# EAGLE schematic untitled (EAGLE 6.2)
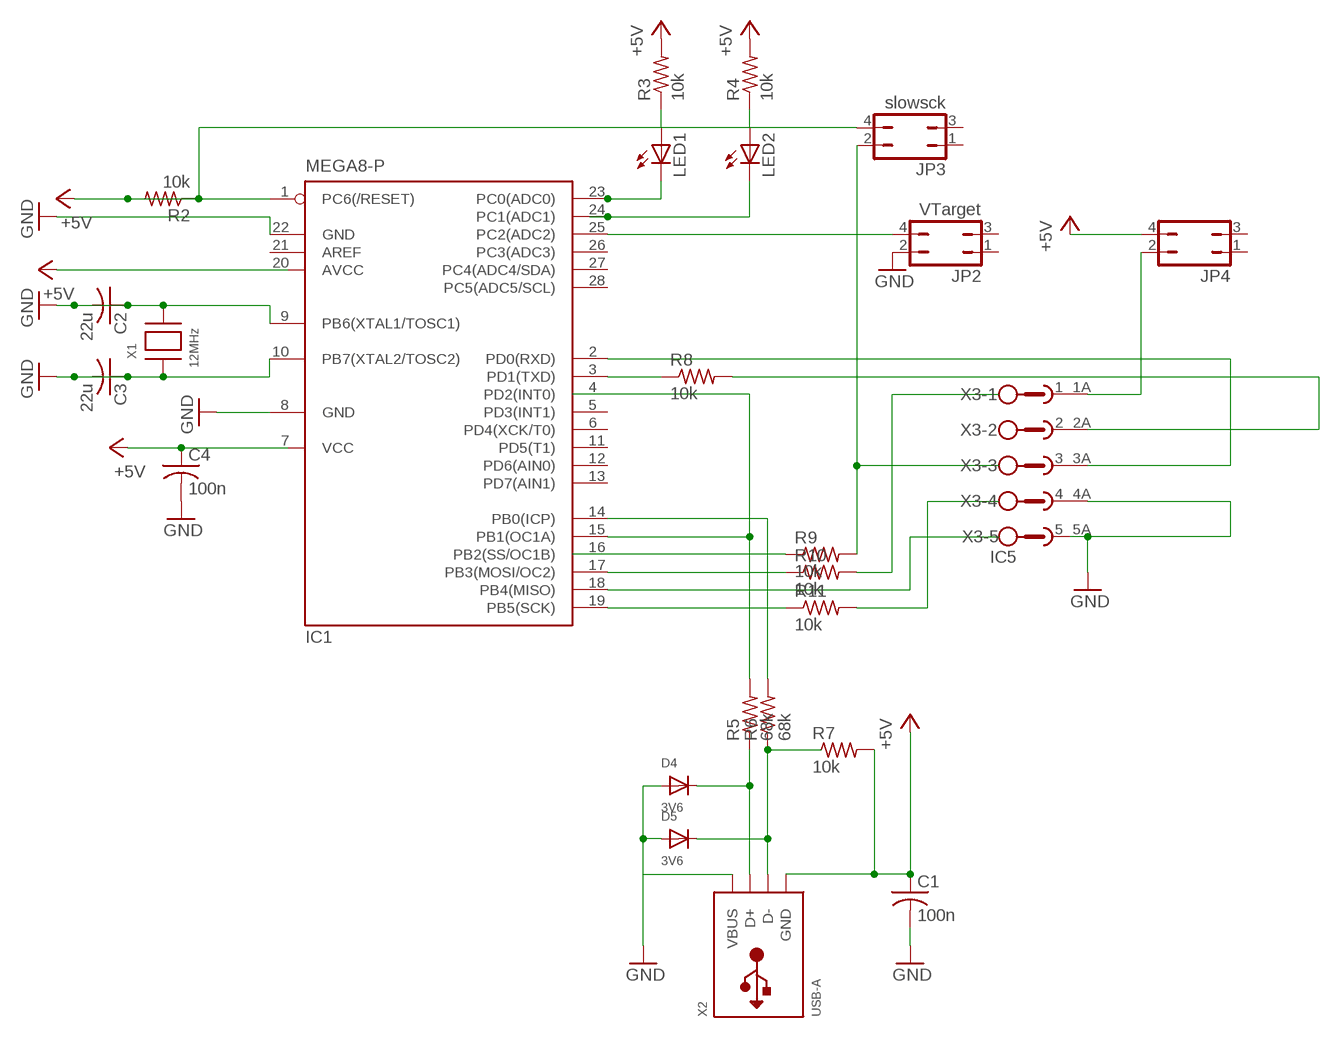
[diagram p0: schematic, sheet 1]

## Parts
C1  100n  C-US025-024X044  [C025-024X044]
C2  22u  C-US025-024X044  [C025-024X044]
C3  22u  C-US025-024X044  [C025-024X044]
C4  100n  C-US025-024X044  [C025-024X044]
D4  3V6  DIODEDO-1N4148  [DO-1N4148]
D5  3V6  DIODEDO-1N4148  [DO-1N4148]
IC1  MEGA8-P  [DIL28-3]
JP2  VTarget  JP2Q  [JP2Q]
JP3  slowsck  JP2Q  [JP2Q]
JP4  JP2Q  [JP2Q]
LED1  LED5MM  [LED5MM]
LED2  LED5MM  [LED5MM]
R2  10k  R-US_0204/2V  [0204V]
R3  10k  R-US_0204/2V  [0204V]
R4  10k  R-US_0204/2V  [0204V]
R5  68k  R-US_0204/2V  [0204V]
R6  68k  R-US_0204/2V  [0204V]
R7  10k  R-US_0204/2V  [0204V]
R8  10k  R-US_0204/2V  [0204V]
R9  10k  R-US_0204/2V  [0204V]
R10  10k  R-US_0204/2V  [0204V]
R11  10k  R-US_0204/2V  [0204V]
X1  12MHz  XTAL-3.2X1.5  [XTAL3215]
X2  USB-A  [MOLEX_480371000]
X3  IC5  [IC5]

## Nets
+5V: C1.1 C4.1 IC1.1(PC6(/RESET)) JP3.4 JP4.4 R2.1 R2.2 R3.2 R4.2 R7.2 X2.4(GND)
GND: C1.2 C2.1 C2.2 C3.1 C3.2 C4.2 D4.A D5.A IC1.8(GND) IC1.9(PB6(XTAL1/TOSC1)) IC1.10(PB7(XTAL2/TOSC2)) IC1.22(GND) JP2.2 X1.P$1 X1.P$2 X2.1(VBUS)
N$1: LED1.A R3.1
N$2: IC1.23(PC0(ADC0)) LED1.K(C)
N$3: IC1.24(PC1(ADC1)) LED2.K(C)
N$4: LED2.A R4.1
N$5: IC1.25(PC2(ADC2)) JP2.4
N$6: D4.C R5.1 X2.3(D+)
N$7: D5.C R6.1 X2.2(D-)
N$8: IC1.15(PB1(OC1A)) R5.2
N$9: IC1.14(PB0(ICP)) R6.2
N$10: JP3.2 R9.2
N$11: IC1.17(PB3(MOSI/OC2)) R10.1
N$12: IC1.19(PB5(SCK)) R11.1
N$13: IC1.18(PB4(MISO))
N$14: R10.2
N$15: R11.2
N$16: JP4.2 X3.1A
N$17: IC1.2(PD0(RXD)) X3.3A
N$19: R8.2 X3.2A
N$20: IC1.3(PD1(TXD)) R8.1
N$21: R9.1
N$22: X3.4A X3.5 X3.5A ; supply symbol labelled GND
Unconnected: IC1.4(PD2(INT0)) IC1.5(PD3(INT1)) IC1.6(PD4(XCK/T0)) IC1.11(PD5(T1)) IC1.12(PD6(AIN0)) IC1.13(PD7(AIN1)) IC1.16(PB2(SS/OC1B)) IC1.21(AREF) IC1.26(PC3(ADC3)) IC1.27(PC4(ADC4/SDA)) IC1.28(PC5(ADC5/SCL)) JP2.1 JP2.3 JP3.1 JP3.3 JP4.1 JP4.3 R7.1 X3.1 X3.2 X3.3 X3.4

## Power pins joined to a net without a drawn wire
AVCC: IC1.20(AVCC)
VCC: IC1.7(VCC)

## Library data of the parts
C1-C4 = adafruit:C-US: CAPACITOR, American symbol
D4 D5 = adafruit:DIODE: Diode SMADIODE - SMA Surface Mount Package 20V 1A Schottky Diode Digikey: 641-1014-6-ND DO-1N4148 - Through Hole Small Current Diode SOD-123 20V 1 A (.5mV Vf) Schottky Diode - Digikey: MBRX120TPMSCT-ND SOD-323 10V 570mA (.38mV Vf, 3ns) Schottky Diode - Digikey: ZLLS410CT-ND SOD-523 30V 30mA Schottky Diode (RB751S-40TE61) - Digikey: RB751S-40TE61CT-ND SOT23-R/W - SOT23 Package (R = Solder Paste/Reflow Ovens, W = Hand-Soldering) BAT54Film 40V 300mA - Digikey: 497-7162-1-ND
IC1 = atmel:MEGA8-P: MICROCONTROLLER 8 Kbytes FLASH, 1 kbytes SRAM, 512 bytes EEPROM, USART, 4-channel 10 bit ADC, 2-channel 8 bit ADC Pin compatible with Atmega48, ATMega88, ATMega168 Source: avr.lbr; OC_FARNELL: unknown; OC_NEWARK: unknown
JP2-JP4 = jumper:JP2Q: JUMPER
LED1 LED2 = led:LED: LED OSRAM: - CHIPLED LG R971, LG N971, LY N971, LG Q971, LY Q971, LO R971, LY R971 LH N974, LH R974 LS Q976, LO Q976, LY Q976 LO Q996 - Hyper CHIPLED LW Q18S LB Q993, LB Q99A, LB R99A - SideLED LS A670, LO A670, LY A670, LG A670, LP A670 LB A673, LV A673, LT A673, LW A673 LH A674 LY A675 LS A676, LA A676, LO A676, LY A676, LW A676 LS A679, LY A679, LG A679 - Hyper Micro SIDELED® LS Y876, LA Y876, LO Y876, LY Y876 LT Y87S - SmartLED LW L88C, LW L88S LB L89C, LB L89S, LG L890 LS L89K, LO L89K, LY L89K LS L896, LA L896, LO L896, LY L896 - TOPLED LS T670, LO T670, LY T670, LG T670, LP T670 LSG T670, LSP T670, LSY T670, LOP T670, LYG T670 LG T671, LOG T671, LSG T671 LB T673, LV T673, LT T673, LW T673 LH T674 LS T676, LA T676, LO T676, LY T676, LB T676, LH T676, LSB T676, LW T676 LB T67C, LV T67C, LT T67C, LS T67K, LO T67K, LY T67K, LW E67C LS E67B, LA E67B, LO E67B, LY E67B, LB E67C, LV E67C, LT E67C LW T67C LS T679, LY T679, LG T679 LS T770, LO T770, LY T770, LG T770, LP T770 LB T773, LV T773, LT T773, LW T773 LH T774 LS E675, LA E675, LY E675, LS T675 LS T776, LA T776, LO T776, LY T776, LB T776 LHGB T686 LT T68C, LB T68C - Hyper Mini TOPLED® LB M676 - Mini TOPLED Santana® LG M470 LS M47K, LO M47K, LY M47K Source: http://www.osram.convergy.de LUXEON: - LUMILED® LXK2-PW12-R00, LXK2-PW12-S00, LXK2-PW14-U00, LXK2-PW14-V00 LXK2-PM12-R00, LXK2-PM12-S00, LXK2-PM14-U00 LXK2-PE12-Q00, LXK2-PE12-R00, LXK2-PE12-S00, LXK2-PE14-T00, LXK2-PE14-U00 LXK2-PB12-K00, LXK2-PB12-L00, LXK2-PB12-M00, LXK2-PB14-N00, LXK2-PB14-P00, LXK2-PB14-Q00 LXK2-PR12-L00, LXK2-PR12-M00, LXK2-PR14-Q00, LXK2-PR14-R00 LXK2-PD12-Q00, LXK2-PD12-R00, LXK2-PD12-S00 LXK2-PH12-R00, LXK2-PH12-S00 LXK2-PL12-P00, LXK2-PL12-Q00, LXK2-PL12-R00 Source: www.luxeon.com KINGBRIGHT: KA-3528ASYC Source: www.kingbright.com
R2 R5-R11 = rcl:R-US_: RESISTOR, American symbol
R3 R4 = adafruit:R-US_: RESISTOR, American symbol
X1 = adafruit:XTAL: Low cost SMT crystals, no capacitors included http://www.ladyada.net/library/eagle
X2 = adafruit:USB-A: USB type A 'plug' Used for things that can directly connect to a USB port, say USB key
X3 = con-phoenix-508:IC5: PHOENIX; OC_FARNELL: unknown; OC_NEWARK: unknown